# EAGLE design Main_mouse (EAGLE 8.3.2)
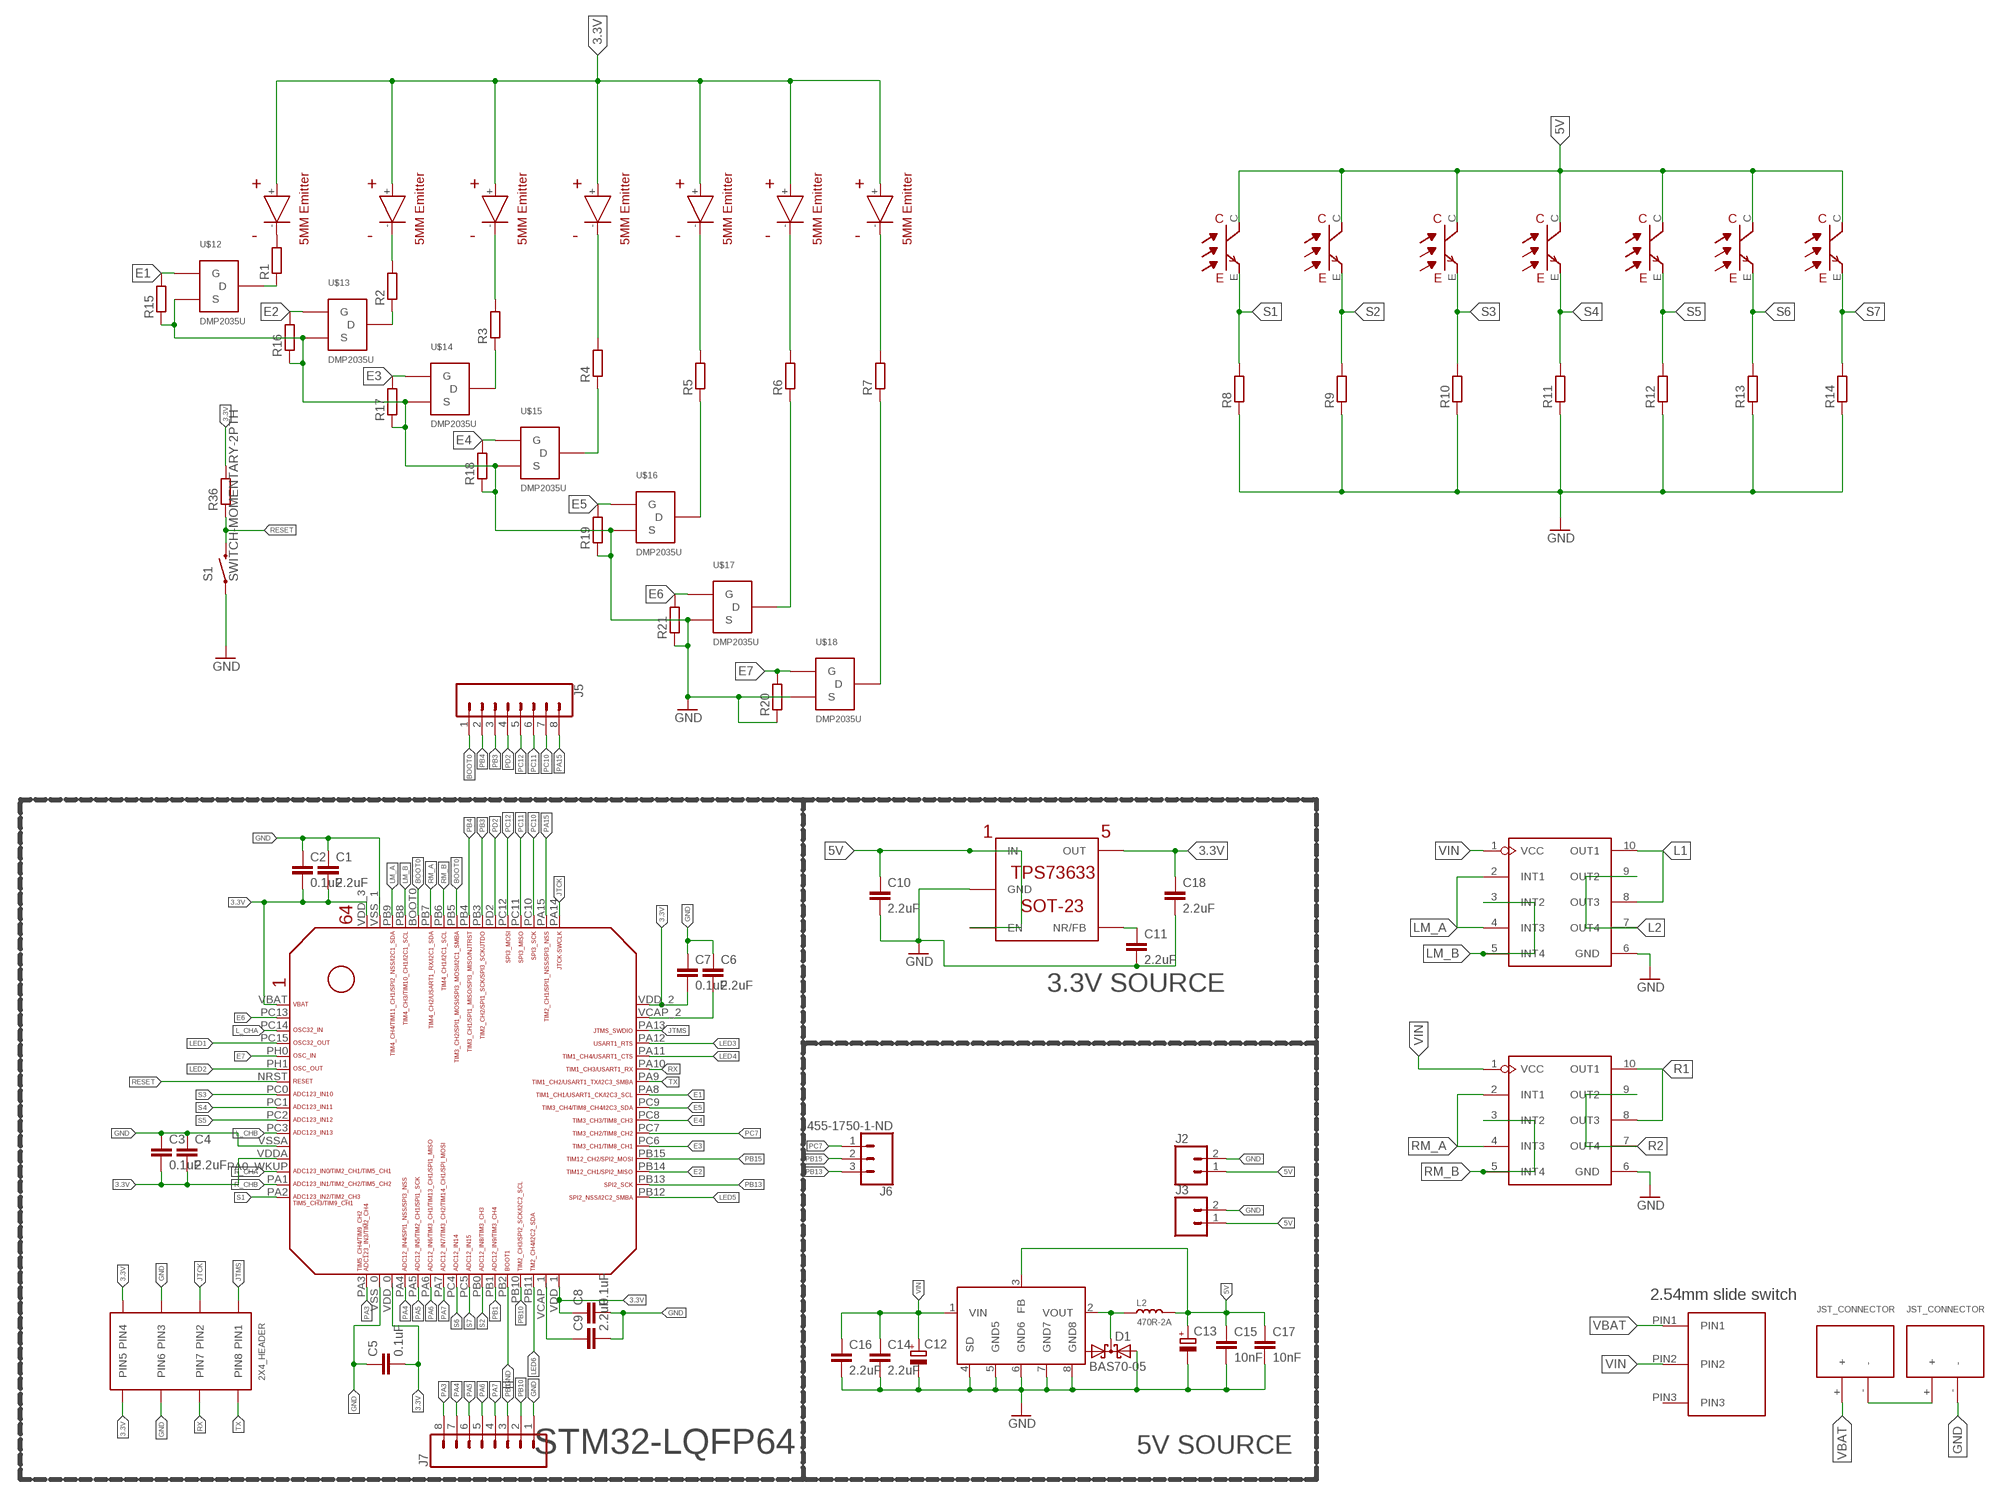
[diagram p0: schematic, sheet 1, part 1 of 2]
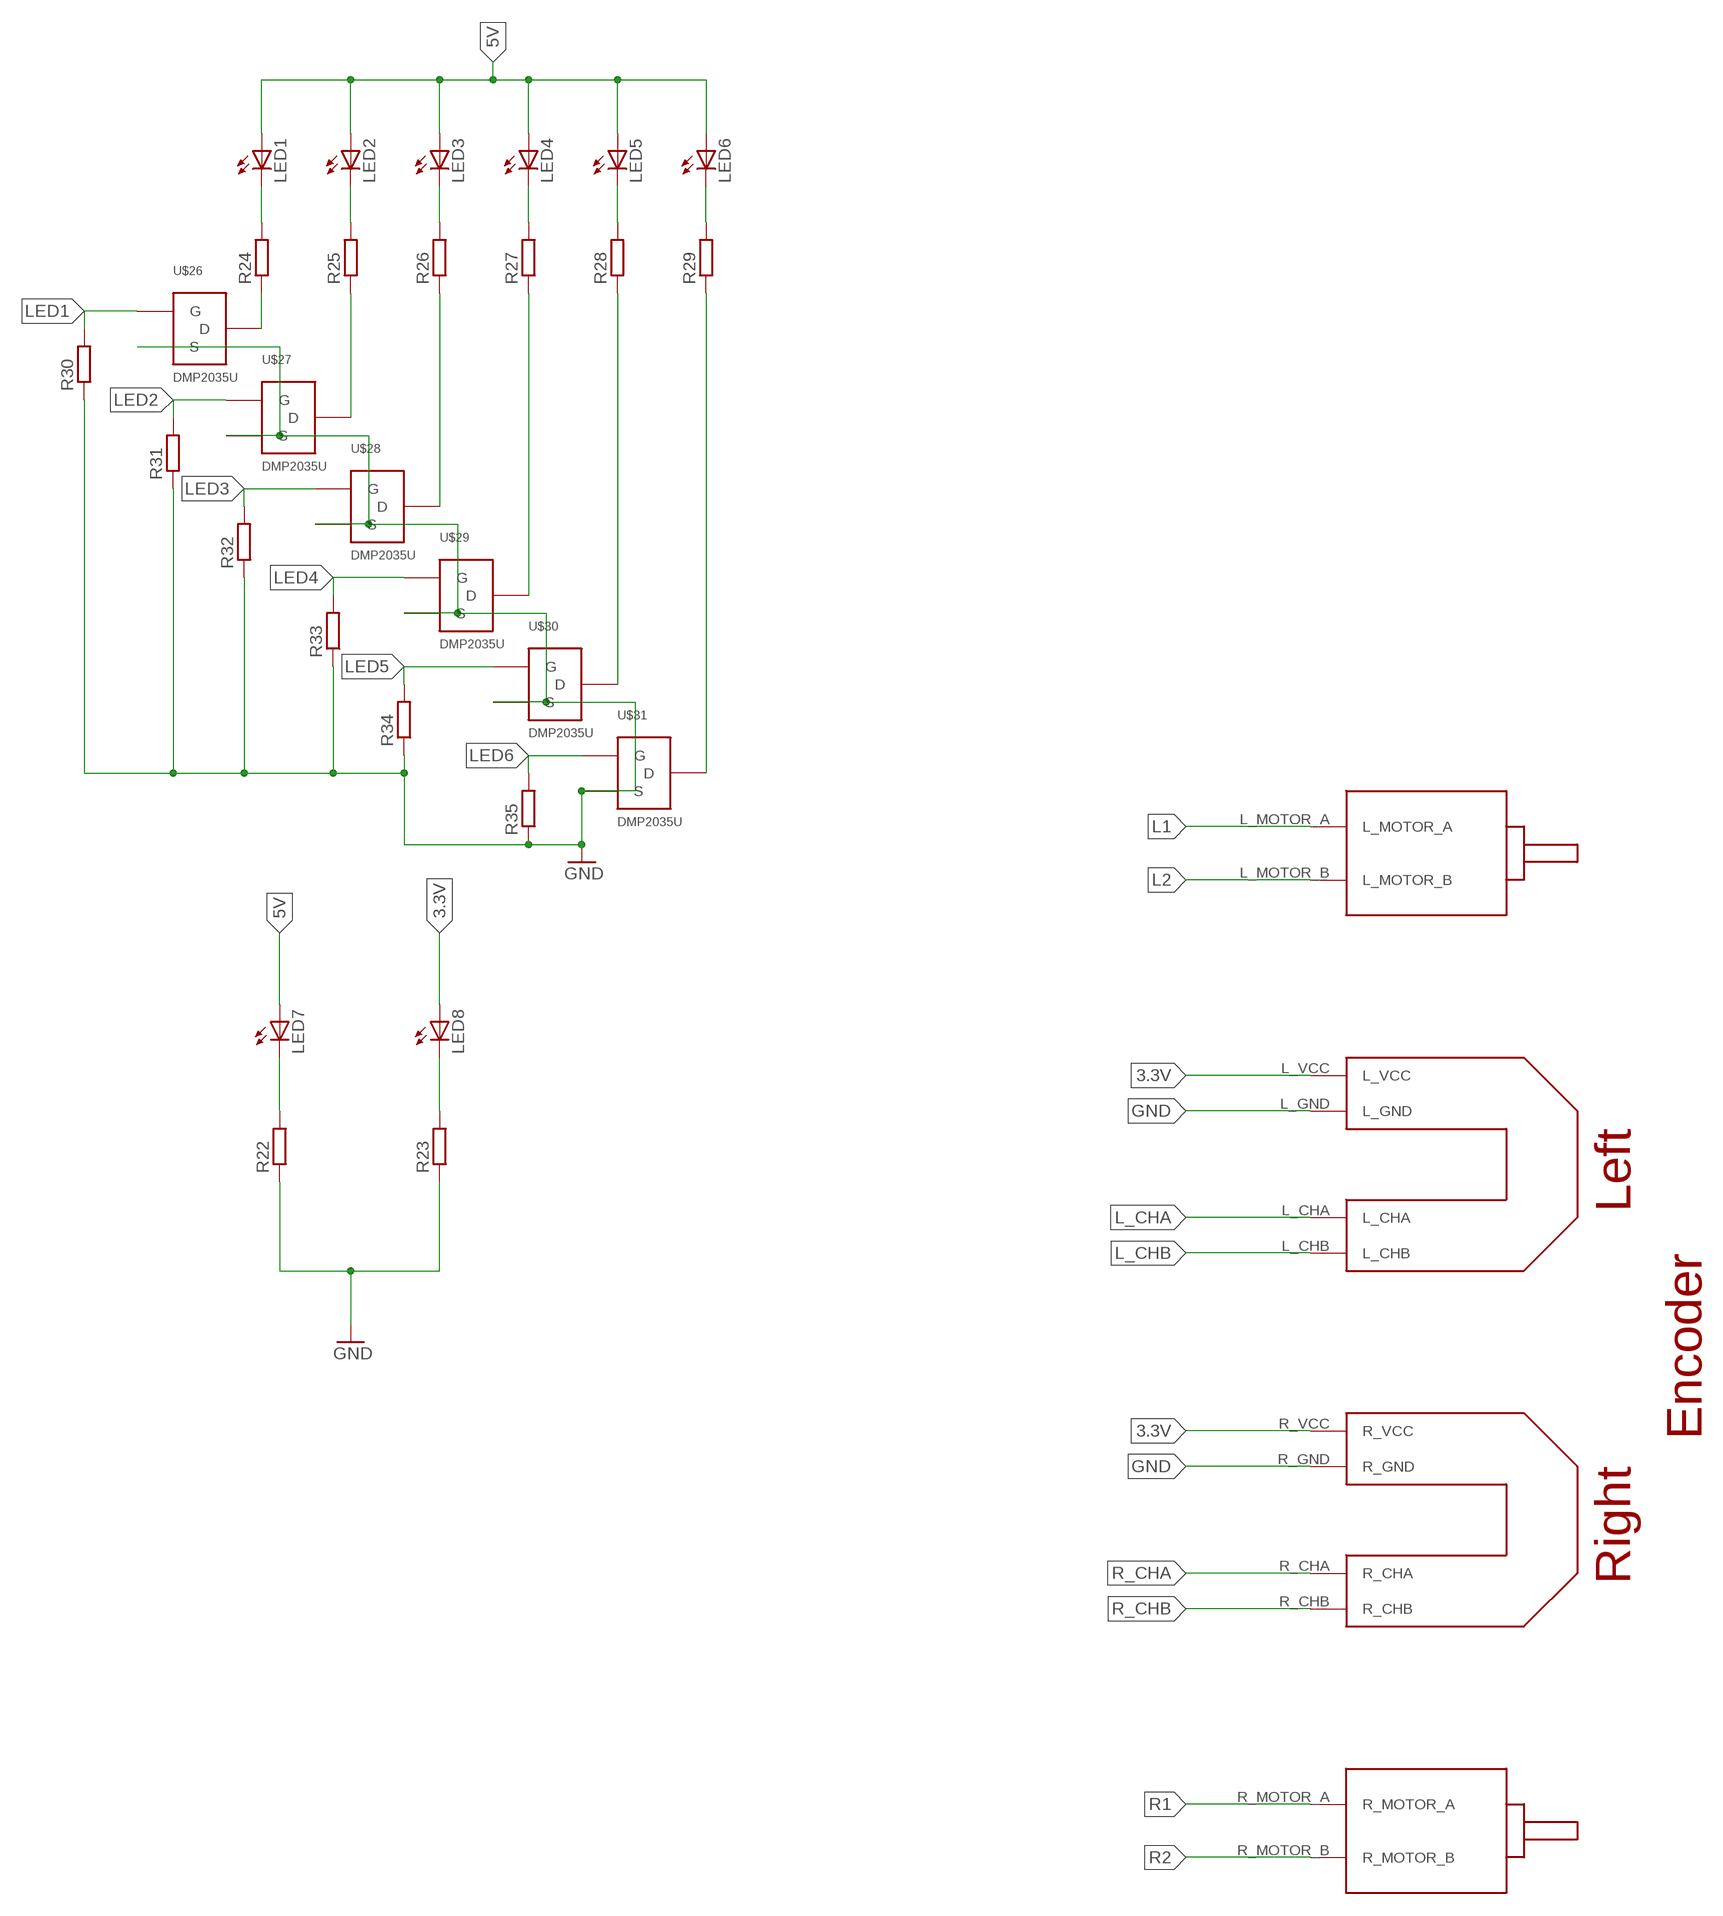
[diagram p1: schematic, sheet 1, part 2 of 2]

## Parts
C1  2.2uF  2.2UF-0603-10V-20%  [0603]
C2  0.1uF  0.1UF-0603-25V-(+80/-20%)  [0603]
C3  0.1uF  0.1UF-0603-25V-(+80/-20%)  [0603]
C4  2.2uF  2.2UF-0603-10V-20%  [0603]
C5  0.1uF  0.1UF-0603-25V-(+80/-20%)  [0603]
C6  2.2uF  2.2UF-0603-10V-20%  [0603]
C7  0.1uF  0.1UF-0603-25V-(+80/-20%)  [0603]
C8  0.1uF  0.1UF-0603-25V-(+80/-20%)  [0603]
C9  2.2uF  2.2UF-0603-10V-20%  [0603]
C10  2.2uF  2.2UF-0603-10V-20%  [0603]
C11  2.2uF  2.2UF-0603-10V-20%  [0603]
C12  CPOL-EUSMCA  [SMC_A]
C13  CPOL-EUSMCC  [SMC_C]
C14  2.2uF  2.2UF-0603-10V-20%  [0603]
C15  10nF  10NF-0603-50V-10%  [0603]
C16  2.2uF  2.2UF-0603-10V-20%  [0603]
C17  10nF  10NF-0603-50V-10%  [0603]
C18  2.2uF  2.2UF-0603-10V-20%  [0603]
D1  BAS70-05  [SOT23]
J2  CONN_02PTH3  [1X02_LONGPADS]
J3  CONN_02PTH3  [1X02_LONGPADS]
J5  CONN_08NO_SILK_FEMALE_PTH  [1X08_NO_SILK]
J6  455-1750-1-ND  CONN_03  [1X03]
J7  CONN_08NO_SILK_FEMALE_PTH  [1X08_NO_SILK]
L2  470R-2A  SMD-FERRITE-BEAD-470R-2A(0805)'0805'  [L0805]
LED1  LEDCHIP-LED0603  [CHIP-LED0603]
LED2  LEDCHIP-LED0603  [CHIP-LED0603]
LED3  LEDCHIP-LED0603  [CHIP-LED0603]
LED4  LEDCHIP-LED0603  [CHIP-LED0603]
LED5  LEDCHIP-LED0603  [CHIP-LED0603]
LED6  LEDCHIP-LED0603  [CHIP-LED0603]
LED7  LEDCHIP-LED0603  [CHIP-LED0603]
LED8  LEDCHIP-LED0603  [CHIP-LED0603]
R1  R-EU_R0603  [R0603]
R2  R-EU_R0603  [R0603]
R3  R-EU_R0603  [R0603]
R4  R-EU_R0603  [R0603]
R5  R-EU_R0603  [R0603]
R6  R-EU_R0603  [R0603]
R7  R-EU_R0603  [R0603]
R8  R-EU_R0603  [R0603]
R9  R-EU_R0603  [R0603]
R10  R-EU_R0603  [R0603]
R11  R-EU_R0603  [R0603]
R12  R-EU_R0603  [R0603]
R13  R-EU_R0603  [R0603]
R14  R-EU_R0603  [R0603]
R15  R-EU_R0603  [R0603]
R16  R-EU_R0603  [R0603]
R17  R-EU_R0603  [R0603]
R18  R-EU_R0603  [R0603]
R19  R-EU_R0603  [R0603]
R20  R-EU_R0603  [R0603]
R21  R-EU_R0603  [R0603]
R22  R-EU_R0603  [R0603]
R23  R-EU_R0603  [R0603]
R24  R-EU_R0603  [R0603]
R25  R-EU_R0603  [R0603]
R26  R-EU_R0603  [R0603]
R27  R-EU_R0603  [R0603]
R28  R-EU_R0603  [R0603]
R29  R-EU_R0603  [R0603]
R30  R-EU_R0603  [R0603]
R31  R-EU_R0603  [R0603]
R32  R-EU_R0603  [R0603]
R33  R-EU_R0603  [R0603]
R34  R-EU_R0603  [R0603]
R35  R-EU_R0603  [R0603]
R36  R-EU_R0603  [R0603]
S1  SWITCH-MOMENTARY-2PTH  [TACTILE-PTH]
U1  DRIVER-LV8548MC-AH(SOIC10)  [SOIC10-1.0-5X4MM]
U2  DRIVER-LV8548MC-AH(SOIC10)  [SOIC10-1.0-5X4MM]
U$1  STM32F405/415_LQFP64  [STM32F405/415_LQFP64]
U$2  2X3_HEADER  [2X3_HEADER]
U$3  AP1509-50SG-13  [SO08]
U$4  TPS73633(SOT-23)  [TPS73633(SOT-23)]
U$5  EMITTER  [EMITTER]
U$6  EMITTER  [EMITTER]
U$7  EMITTER  [EMITTER]
U$8  EMITTER  [EMITTER]
U$9  EMITTER  [EMITTER]
U$10  EMITTER  [EMITTER]
U$11  EMITTER  [EMITTER]
U$12  DMP2035U  [SOT23]
U$13  DMP2035U  [SOT23]
U$14  DMP2035U  [SOT23]
U$15  DMP2035U  [SOT23]
U$16  DMP2035U  [SOT23]
U$17  DMP2035U  [SOT23]
U$18  DMP2035U  [SOT23]
U$19  RECEIVER  [RECEIVER]
U$20  RECEIVER  [RECEIVER]
U$21  RECEIVER  [RECEIVER]
U$22  RECEIVER  [RECEIVER]
U$23  RECEIVER  [RECEIVER]
U$24  RECEIVER  [RECEIVER]
U$25  RECEIVER  [RECEIVER]
U$26  DMP2035U  [SOT23]
U$27  DMP2035U  [SOT23]
U$28  DMP2035U  [SOT23]
U$29  DMP2035U  [SOT23]
U$30  DMP2035U  [SOT23]
U$31  DMP2035U  [SOT23]
U$32  TS02_SWITCH  [TS02_SWITCH]
U$33  JST_CONNECTOR_FEMALE  [JST_CONNECTOR_FEMALE]
U$34  JST_CONNECTOR_FEMALE  [JST_CONNECTOR_FEMALE]
U$35  FUTURA_V1.0_MOTOR_MOUNT  [FUTURA_V1.0_MOTOT_MOUNT]

## Nets
3.3V: C1.2 C2.2 C3.2 C4.2 C5.2 C7.2 C8.1 C18.1 LED8.A R36.2 U$1.VBAT U$1.VDD_0 U$1.VDD_1 U$1.VDD_2 U$1.VDD_3 U$1.VDDA U$2.PIN4 U$2.PIN5 U$4.OUT U$5.+ U$6.+ U$7.+ U$8.+ U$9.+ U$10.+ U$11.+ U$35.L_VCC U$35.R_VCC
5V: C10.1 C13.+ C15.1 C17.1 J2.1 J3.1 L2.2 LED1.A LED2.A LED3.A LED4.A LED5.A LED6.A LED7.A U$3.3(FB) U$4.EN U$4.IN U$19.C U$20.C U$21.C U$22.C U$23.C U$24.C U$25.C
BOOT0: J5.1 U$1.BOOT0 U$1.PB5
E1: R15.2 U$1.PA8 U$12.1(G)
E2: R16.2 U$1.PB14 U$13.1(G)
E3: R17.2 U$1.PC6 U$14.1(G)
E4: R18.2 U$1.PC8 U$15.1(G)
E5: R19.2 U$1.PC9 U$16.1(G)
E6: R21.2 U$1.PC13 U$17.1(G)
E7: R20.2 U$1.PH0 U$18.1(G)
GND: C1.1 C2.1 C3.1 C4.1 C5.1 C6.1 C7.1 C8.2 C9.2 C10.2 C11.2 C12.- C13.- C14.2 C15.2 C16.2 C17.2 C18.2 D1.2(A2) J2.2 J3.2 J7.1 R8.1 R9.1 R10.1 R11.1 R12.1 R13.1 R14.1 R15.1 R16.1 R17.1 R18.1 R19.1 R20.1 R21.1 R22.1 R23.1 R30.1 R31.1 R32.1 R33.1 R34.1 R35.1 S1.1 U1.6(GND) U2.6(GND) U$1.PB2 U$1.VSS_0 U$1.VSS_1 U$1.VSSA U$2.PIN3 U$2.PIN6 U$3.4(SD) U$3.5(GND5) U$3.6(GND6) U$3.7(GND7) U$3.8(GND8) U$4.GND U$12.2(S) U$13.2(S) U$14.2(S) U$15.2(S) U$16.2(S) U$17.2(S) U$18.2(S) U$26.2(S) U$27.2(S) U$28.2(S) U$29.2(S) U$30.2(S) U$31.2(S) U$34.- U$35.L_GND U$35.R_GND
JTCK: U$1.PA14 U$2.PIN2
JTMS: U$1.PA13 U$2.PIN1
L1: U1.8(OUT3) U1.10(OUT1) U$35.L_MOTOR_A
L2: U1.7(OUT4) U1.9(OUT2) U$35.L_MOTOR_B
L_CHA: U$1.PC14 U$35.L_CHA
L_CHB: U$1.PC3 U$35.L_CHB
LED1: R30.2 U$1.PC15 U$26.1(G)
LED2: R31.2 U$1.PH1 U$27.1(G)
LED3: R32.2 U$1.PA12 U$28.1(G)
LED4: R33.2 U$1.PA11 U$29.1(G)
LED5: R34.2 U$1.PB12 U$30.1(G)
LED6: R35.2 U$1.PB11 U$31.1(G)
LM_A: U1.2(INT1) U1.4(INT3) U$1.PB9
LM_B: U1.3(INT2) U1.5(INT4) U$1.PB8
N$1: C9.1 U$1.VCAP_1
N$2: C6.2 U$1.VCAP_2
N$3: R1.1 U$12.3(D)
N$4: D1.3(C) L2.1 U$3.2(VOUT)
N$5: C11.1 U$4.NR/FB
N$6: R2.2 U$6.-
N$7: R2.1 U$13.3(D)
N$8: R4.1 U$15.3(D)
N$10: R3.1 U$14.3(D)
N$11: R6.1 U$17.3(D)
N$12: R3.2 U$7.-
N$13: R1.2 U$5.-
N$14: R4.2 U$8.-
N$15: R5.2 U$9.-
N$16: R5.1 U$16.3(D)
N$17: R6.2 U$10.-
N$18: R7.1 U$18.3(D)
N$19: R7.2 U$11.-
N$20: LED7.C R22.2
N$21: LED8.C R23.2
N$22: LED1.C R24.2
N$23: LED2.C R25.2
N$24: LED3.C R26.2
N$25: LED4.C R27.2
N$26: LED5.C R28.2
N$27: LED6.C R29.2
N$28: R24.1 U$26.3(D)
N$29: R25.1 U$27.3(D)
N$30: R26.1 U$28.3(D)
N$31: R27.1 U$29.3(D)
N$32: R29.1 U$31.3(D)
N$33: R28.1 U$30.3(D)
N$34: U$33.- U$34.+
PA3: J7.8 U$1.PA3
PA4: J7.7 U$1.PA4
PA5: J7.6 U$1.PA5
PA6: J7.5 U$1.PA6
PA7: J7.4 U$1.PA7
PA15: J5.8 U$1.PA15
PB1: J7.3 U$1.PB1
PB3: J5.3 U$1.PB3
PB4: J5.2 U$1.PB4
PB10: J7.2 U$1.PB10
PB13: J6.3 U$1.PB13
PB15: J6.2 U$1.PB15
PC7: J6.1 U$1.PC7
PC10: J5.7 U$1.PC10
PC11: J5.6 U$1.PC11
PC12: J5.5 U$1.PC12
PD2: J5.4 U$1.PD2
R1: U2.8(OUT3) U2.10(OUT1) U$35.R_MOTOR_A
R2: U2.7(OUT4) U2.9(OUT2) U$35.R_MOTOR_B
R_CHA: U$1.PA0_WKUP(PA0_AKUP) U$35.R_CHA
R_CHB: U$1.PA1 U$35.R_CHB
RESET: R36.1 S1.3 U$1.NRST
RM_A: U2.2(INT1) U2.4(INT3) U$1.PB7
RM_B: U2.3(INT2) U2.5(INT4) U$1.PB6
RX: U$1.PA10 U$2.PIN7
S1: R8.2 U$1.PA2 U$19.E
S2: R9.2 U$1.PB0 U$20.E
S3: R10.2 U$1.PC0 U$21.E
S4: R11.2 U$1.PC1 U$22.E
S5: R12.2 U$1.PC2 U$23.E
S6: R13.2 U$1.PC4 U$24.E
S7: R14.2 U$1.PC5 U$25.E
TX: U$1.PA9 U$2.PIN8
VBAT: U$32.PIN1 U$33.+
VIN: C12.+ C14.1 C16.1 U1.1(VCC) U2.1(VCC) U$3.1(VIN) U$32.PIN2
Unconnected: D1.1(A1) U$32.PIN3

## Notes on the sheet
- 3.3V SOURCE
- STM32-LQFP64 | 5V SOURCE

## Library data of the parts
C1 C4 C6 C9-C11 C14 C16 C18 = SparkFun-Capacitors:2.2UF: 2.2µF ceramic capacitors A capacitor is a passive two-terminal electrical component used to store electrical energy temporarily in an electric field.; PROD_ID: CAP-07888
C2 C3 C5 C7 C8 = SparkFun-Capacitors:0.1UF: 0.1µF ceramic capacitors A capacitor is a passive two-terminal electrical component used to store electrical energy temporarily in an electric field.; PROD_ID: CAP-00810
C12 C13 = resistor:CPOL-EU: POLARIZED CAPACITOR, European symbol
C15 C17 = SparkFun-Capacitors:10NF: 0.01uF/10nF/10,000pF ceramic capacitors A capacitor is a passive two-terminal electrical component used to store electrical energy temporarily in an electric field. CAP-09321; PROD_ID: CAP-00867
D1 = diode:BAS70-05: Silicon Schottky Diodes General-purpose diode for high-speed switching
J2 J3 = SparkFun-Connectors:CONN_02: Multi connection point. Often used as Generic Header-pin footprint for 0.1 inch spaced/style header connections On any of the 0.1 inch spaced packages, you can populate with these: Break Away Headers - Straight <https://www.sparkfun.com/products/116> (PRT-00116) Break Away Male Headers - Right Angle <https://www.sparkfun.com/products/553> (PRT-00553) Female Headers <https://www.sparkfun.com/products/115> (PRT-00115) Break Away Headers - Machine Pin <https://www.sparkfun.com/products/117> (PRT-00117) Break Away Female Headers - Swiss Machine Pin <https://www.sparkfun.com/products/743> (PRT-00743) For SCREWTERMINALS and SPRING TERMINALS visit here: Screw Terimnals on SparkFun.com <https://www.sparkfun.com/search/results?term=Screw+Terminals> (5mm/3.5mm/2.54mm spacing) This device is also useful as a general connection point to wire up your design to another part of your project. Our various solder wires solder well into these plated through hole pads. Hook-Up Wire - Assortment (Stranded, 22 AWG) <https://www.sparkfun.com/products/11375> (PRT-11375) Hook-Up Wire - Assortment (Solid Core, 22 AWG) <https://www.sparkfun.com/products/11367> (PRT-11367) View the entire wire category on our website here <https://www.sparkfun.com/categories/141> Special notes: Molex polarized connector foot print use with: PRT-08233 with associated crimp pins and housings. 2.54_SCREWTERM for use with PRT-10571. 3.5mm Screw Terminal footprints for PRT-08084 5mm Screw Terminal footprints for use with PRT-08432
J5 J7 = SparkFun-Connectors:CONN_08: Multi connection point. Often used as Generic Header-pin footprint for 0.1 inch spaced/style header connections On any of the 0.1 inch spaced packages, you can populate with these: Break Away Headers - Straight <https://www.sparkfun.com/products/116> (PRT-00116) Break Away Male Headers - Right Angle <https://www.sparkfun.com/products/553> (PRT-00553) Female Headers <https://www.sparkfun.com/products/115> (PRT-00115) Break Away Headers - Machine Pin <https://www.sparkfun.com/products/117> (PRT-00117) Break Away Female Headers - Swiss Machine Pin <https://www.sparkfun.com/products/743> (PRT-00743) Arduino Stackable Header - 8 Pin <https://www.sparkfun.com/products/9279> (PRT-09279) For SCREWTERMINALS and SPRING TERMINALS visit here: Screw Terimnals on SparkFun.com <https://www.sparkfun.com/search/results?term=Screw+Terminals> (5mm/3.5mm/2.54mm spacing) This device is also useful as a general connection point to wire up your design to another part of your project. Our various solder wires solder well into these plated through hole pads. Hook-Up Wire - Assortment (Stranded, 22 AWG) <https://www.sparkfun.com/products/11375> (PRT-11375) Hook-Up Wire - Assortment (Solid Core, 22 AWG) <https://www.sparkfun.com/products/11367> (PRT-11367) View the entire wire category on our website here <https://www.sparkfun.com/categories/141> Special notes: Molex polarized connector foot print use with SKU : PRT-08231 with associated crimp pins and housings. 1MM SMD Version SKU: PRT-10208 NOTES ON THE VARIANTS LOCK and LOCK_LONGPADS... This footprint was designed to help hold the alignment of a through-hole component (i.e. 6-pin header) while soldering it into place. You may notice that each hole has been shifted either up or down by 0.005 of an inch from it's more standard position (which is a perfectly straight line). This slight alteration caused the pins (the squares in the middle) to touch the edges of the holes. Because they are alternating, it causes a "brace" to hold the component in place. 0.005 has proven to be the perfect amount of "off-center" position when using our standard breakaway headers. Although looks a little odd when you look at the bare footprint, once you have a header in there, the alteration is very hard to notice. Also,if you push a header all the way into place, it is covered up entirely on the bottom side.; PROD_ID: CONN-08438
J6 = SparkFun-Connectors:CONN_03: Multi connection point. Often used as Generic Header-pin footprint for 0.1 inch spaced/style header connections On any of the 0.1 inch spaced packages, you can populate with these: Break Away Headers - Straight <https://www.sparkfun.com/products/116> (PRT-00116) Break Away Male Headers - Right Angle <https://www.sparkfun.com/products/553> (PRT-00553) Female Headers <https://www.sparkfun.com/products/115> (PRT-00115) Break Away Headers - Machine Pin <https://www.sparkfun.com/products/117> (PRT-00117) Break Away Female Headers - Swiss Machine Pin <https://www.sparkfun.com/products/743> (PRT-00743) Stackable Header - 3 Pin (Female, 0.1") <https://www.sparkfun.com/products/13875> (PRT-13875) For SCREWTERMINALS and SPRING TERMINALS visit here: Screw Terimnals on SparkFun.com <https://www.sparkfun.com/search/results?term=Screw+Terminals> (5mm/3.5mm/2.54mm spacing) This device is also useful as a general connection point to wire up your design to another part of your project. Our various solder wires solder well into these plated through hole pads. Hook-Up Wire - Assortment (Stranded, 22 AWG) <https://www.sparkfun.com/products/11375> (PRT-11375) Hook-Up Wire - Assortment (Solid Core, 22 AWG) <https://www.sparkfun.com/products/11367> (PRT-11367) View the entire wire category on our website here <https://www.sparkfun.com/categories/141> Special notes: Molex polarized connector foot print use with SKU : PRT-08232 with associated crimp pins and housings.; PROD_ID: XXX-00000
L2 = Seeed-Inductor:SMD-FERRITE-BEAD-470R-2A(0805): 303030008; MPN: WLB2012-471T20
LED1-LED8 = led:LED: LED OSRAM: - CHIPLED LG R971, LG N971, LY N971, LG Q971, LY Q971, LO R971, LY R971 LH N974, LH R974 LS Q976, LO Q976, LY Q976 LO Q996 - Hyper CHIPLED LW Q18S LB Q993, LB Q99A, LB R99A - SideLED LS A670, LO A670, LY A670, LG A670, LP A670 LB A673, LV A673, LT A673, LW A673 LH A674 LY A675 LS A676, LA A676, LO A676, LY A676, LW A676 LS A679, LY A679, LG A679 - Hyper Micro SIDELED® LS Y876, LA Y876, LO Y876, LY Y876 LT Y87S - SmartLED LW L88C, LW L88S LB L89C, LB L89S, LG L890 LS L89K, LO L89K, LY L89K LS L896, LA L896, LO L896, LY L896 - TOPLED LS T670, LO T670, LY T670, LG T670, LP T670 LSG T670, LSP T670, LSY T670, LOP T670, LYG T670 LG T671, LOG T671, LSG T671 LB T673, LV T673, LT T673, LW T673 LH T674 LS T676, LA T676, LO T676, LY T676, LB T676, LH T676, LSB T676, LW T676 LB T67C, LV T67C, LT T67C, LS T67K, LO T67K, LY T67K, LW E67C LS E67B, LA E67B, LO E67B, LY E67B, LB E67C, LV E67C, LT E67C LW T67C LS T679, LY T679, LG T679 LS T770, LO T770, LY T770, LG T770, LP T770 LB T773, LV T773, LT T773, LW T773 LH T774 LS E675, LA E675, LY E675, LS T675 LS T776, LA T776, LO T776, LY T776, LB T776 LHGB T686 LT T68C, LB T68C - Hyper Mini TOPLED® LB M676 - Mini TOPLED Santana® LG M470 LS M47K, LO M47K, LY M47K Source: http://www.osram.convergy.de LUXEON: - LUMILED® LXK2-PW12-R00, LXK2-PW12-S00, LXK2-PW14-U00, LXK2-PW14-V00 LXK2-PM12-R00, LXK2-PM12-S00, LXK2-PM14-U00 LXK2-PE12-Q00, LXK2-PE12-R00, LXK2-PE12-S00, LXK2-PE14-T00, LXK2-PE14-U00 LXK2-PB12-K00, LXK2-PB12-L00, LXK2-PB12-M00, LXK2-PB14-N00, LXK2-PB14-P00, LXK2-PB14-Q00 LXK2-PR12-L00, LXK2-PR12-M00, LXK2-PR14-Q00, LXK2-PR14-R00 LXK2-PD12-Q00, LXK2-PD12-R00, LXK2-PD12-S00 LXK2-PH12-R00, LXK2-PH12-S00 LXK2-PL12-P00, LXK2-PL12-Q00, LXK2-PL12-R00 Source: www.luxeon.com KINGBRIGHT: KA-3528ASYC Source: www.kingbright.com
R1-R36 = resistor:R-EU_: RESISTOR, European symbol
S1 = SparkFun:SWITCH-MOMENTARY-2
U1 U2 = DRIVER-LV8548MC-AH_SOIC10_:DRIVER-LV8548MC-AH(SOIC10): 310030259; AVAILABILITY: Unavailable; DESCRIPTION: LV8548MC Series 16 V 1 A 1 W Dual Ch Forward/Reverse Motor Driver - MFP-10S; MF: ON Semiconductor; MP: LV8548MC-AH; PACKAGE: SOIC-10 ON Semiconductor; PRICE: None
U$1 = STM32F10x F4xx:STM32F405/415_LQFP64
U$2 = 2X4_HEADER:2X3_HEADER
U$3 = AP1509-50SG-13:AP1509-50SG-13; AVAILABILITY: Unavailable; DESCRIPTION: Voltage Regulators - Switching SW REG CNV BUCK ASYN 150K 1.4 22V 5.0V; MF: Diodes Inc.; MP: AP1509-50SG-13; PACKAGE: SOP-8 Diodes Inc.; PRICE: None
U$4 = TPS73633(SOT-23):TPS73633(SOT-23)
U$5-U$11 = sfh4550 & teft4300:EMITTER
U$12-U$18 U$26-U$31 = DMP2035U:DMP2035U: Diodes Inc. DMP2035U-7 P-channel logic level mosfet; AVAILABILITY: Unavailable; DESCRIPTION: MOSFET, P CH, ESD, 20V, 3.6A, SOT23; Transistor Polarity: P Channel; Continuous Drain Current Id: -3.6A; Drain Source...; MF: Diodes Inc.; MP: DMP2035U; PACKAGE: SOT-23-3 Diodes Inc.; PRICE: None
U$19-U$25 = sfh4550 & teft4300:RECEIVER
U$32 = 2.54mm slide switch:TS02_SWITCH
U$33 U$34 = JST_CONNECTOR_FEMALE. through hole:JST_CONNECTOR_FEMALE
U$35 = Futura 1.0 motor mount template:FUTURA_V1.0_MOTOR_MOUNT

## Board
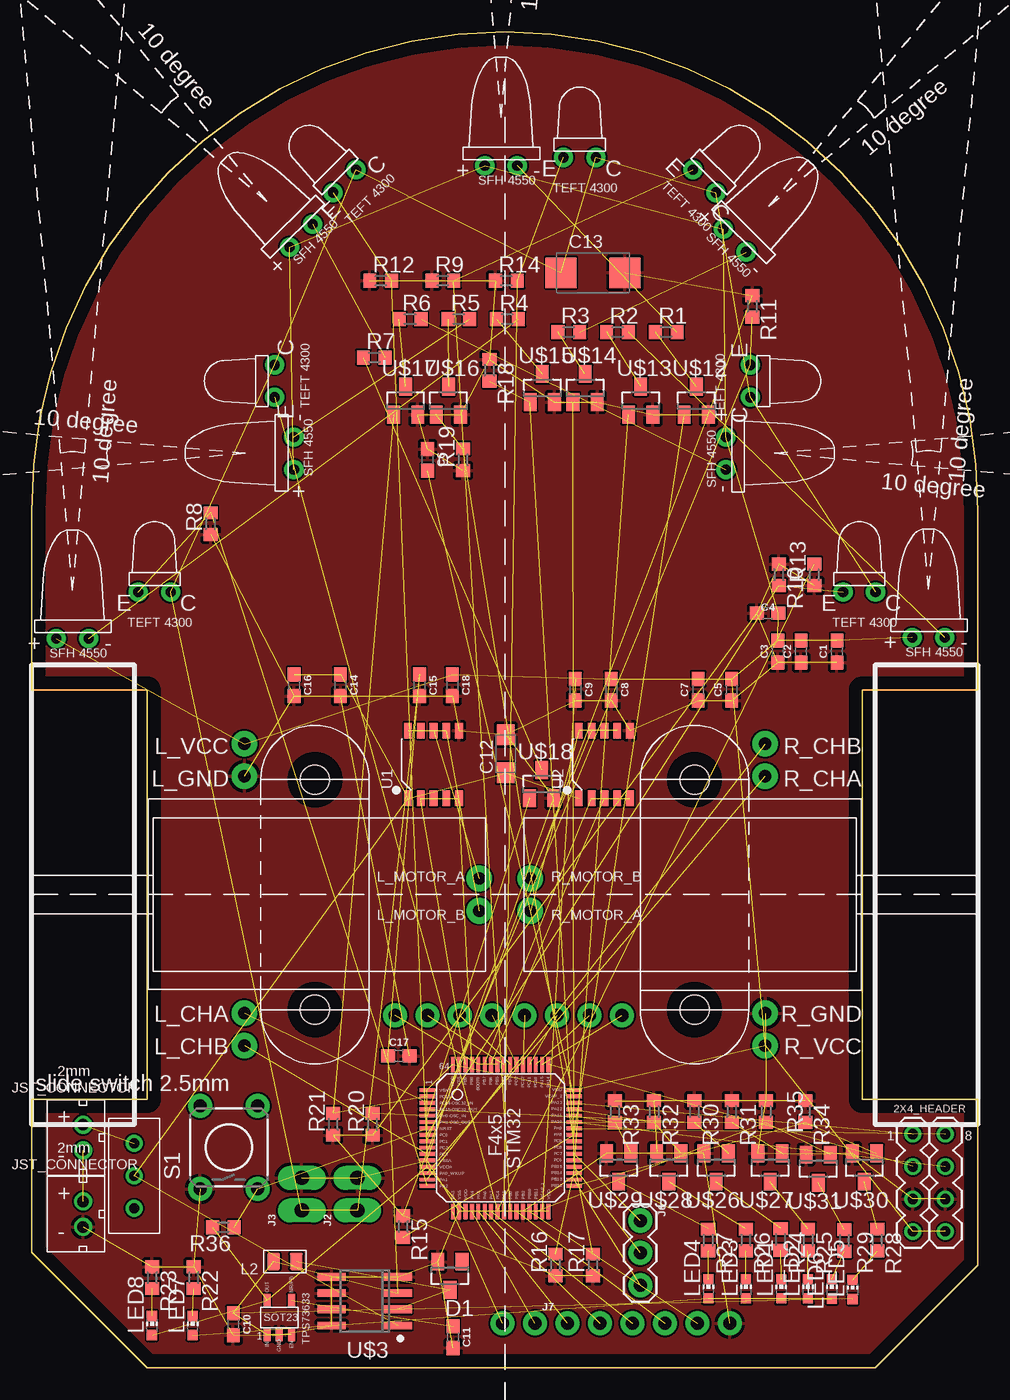
[diagram p2: board, top side]
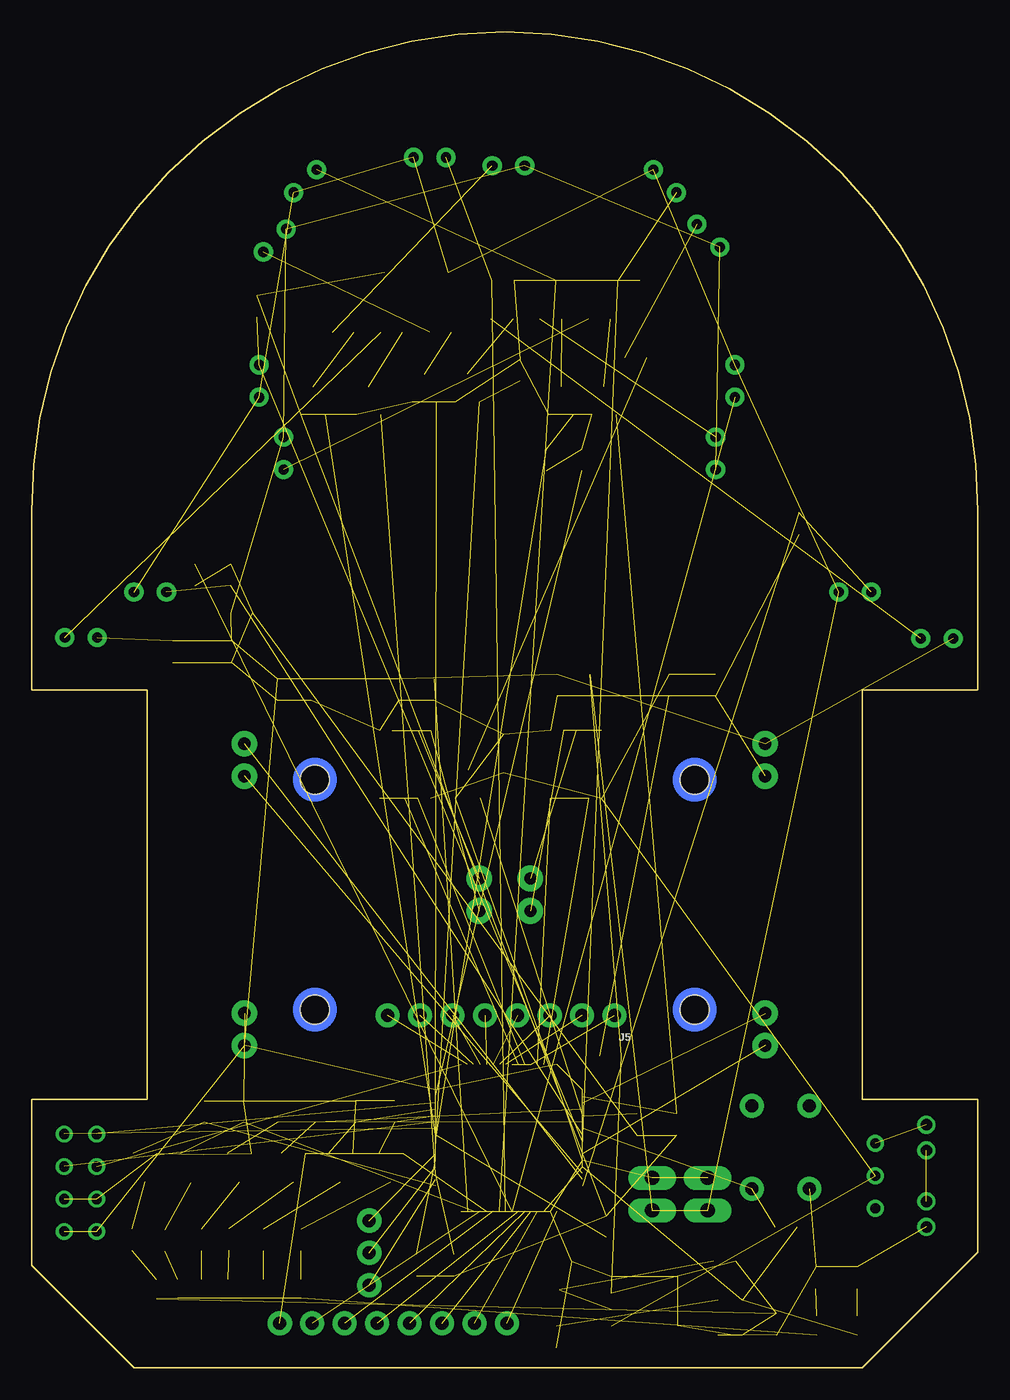
[diagram p3: board, bottom side, seen from below]

Size 74 x 104.5 mm. Coordinates in mm from the lower left corner, seen from the top.
Outline: 0,17 0,9 9,0 66,0 74,8 74,17
Outline: 0,57 0,67 arc-182 74,67 74,57
Copper layers (1*16): Top 0.035mm / dielectric 1.5mm / Bottom 0.035mm
Design rules "default": minimum track width 6mil, minimum drill 0.35mm, track to track 6mil, track to pad 6mil, pad to pad 6mil, via to via 6mil, smd to smd 6mil, copper to edge 40mil, drill to drill 6mil, minimum pad ring 10mil, minimum via ring 8mil, stop-mask expansion 4mil, vias tented up to drill 0mil, thermal gap 10mil

### Footprints (pad centres in the part's own frame; a part is rotated, then mirrored left to right if it is on the bottom)
0603 = smd 1.1 x 1: 1 -0.85,0; 2 0.85,0
SMC_A = smd 1.6 x 1.4: + -1.5,0; - 1.5,0
SMC_C = smd 2.4 x 2.4: + -2.5,0; - 2.5,0
SOT23 = smd 1 x 1.4: 1 -0.95,-1.1; 2 0.95,-1.1; 3 0,1.1
1X02_LONGPADS = drill 1.118 pad 1.88 long: 1 0,0; 2 2.54,0
1X08_NO_SILK = drill 1.016 pad 1.88: 1 0,0; 2 2.54,0; 3 5.08,0; 4 7.62,0; 5 10.16,0; 6 12.7,0; 7 15.24,0; 8 17.78,0
1X03 = drill 1.016 pad 1.88: 1 0,0; 2 2.54,0; 3 5.08,0
L0805 = smd 1.016 x 1.397: 1 -0.889,0; 2 0.889,0
CHIP-LED0603 = smd 0.8 x 0.8: A 0,-0.75; C 0,0.75
R0603 = smd 1 x 1.1: 1 -0.85,0; 2 0.85,0
TACTILE-PTH = drill 1.016 pad 1.88: 1 -3.251,2.261; 2 3.251,2.261; 3 -3.251,-2.261; 4 3.251,-2.261
SOIC10-1.0-5X4MM = smd 0.6 x 1.2: 1 -2,-2.65; 2 -1,-2.65; 3 0,-2.65; 4 1,-2.65; 5 2,-2.65; 6 2,2.65; 7 1,2.65; 8 0,2.65; 9 -1,2.65; 10 -2,2.65
STM32F405/415_LQFP64 = smd 1.2 x 0.3: BOOT0 -5.75,-1.75; PA3 5.75,-3.75; PA4 5.75,-2.25; PA5 5.75,-1.75; PA6 5.75,-1.25; PA7 5.75,-0.75; PA14 -5.75,3.75; PA15 -5.75,3.25; PB0 5.75,0.75; PB1 5.75,1.25; PB2 5.75,1.75; PB3 -5.75,0.75; PB4 -5.75,0.25; PB5 -5.75,-0.25; PB6 -5.75,-0.75; PB7 -5.75,-1.25; PB8 -5.75,-2.25; PB9 -5.75,-2.75; PB10 5.75,2.25; PB11 5.75,2.75; PC4 5.75,-0.25; PC5 5.75,0.25; PC10 -5.75,2.75; PC11 -5.75,2.25; PC12 -5.75,1.75; PD2 -5.75,1.25; VCAP_1 5.75,3.25; VDD_0 5.75,-2.75; VDD_1 5.75,3.75; VDD_3 -5.75,-3.75; VSS_0 5.75,-3.25; VSS_1 -5.75,-3.25 | smd 0.3 x 1.2: NRST -0.75,-5.75; PA0_WKUP 2.75,-5.75; PA1 3.25,-5.75; PA2 3.75,-5.75; PA8 -0.25,5.75; PA9 -0.75,5.75; PA10 -1.25,5.75; PA11 -1.75,5.75; PA12 -2.25,5.75; PA13 -2.75,5.75; PB12 3.75,5.75; PB13 3.25,5.75; PB14 2.75,5.75; PB15 2.25,5.75; PC0 -0.25,-5.75; PC1 0.25,-5.75; PC2 0.75,-5.75; PC3 1.25,-5.75; PC6 1.75,5.75; PC7 1.25,5.75; PC8 0.75,5.75; PC9 0.25,5.75; PC13 -3.25,-5.75; PC14 -2.75,-5.75; PC15 -2.25,-5.75; PH0 -1.75,-5.75; PH1 -1.25,-5.75; VBAT -3.75,-5.75; VCAP_2 -3.25,5.75; VDD_2 -3.75,5.75; VDDA 2.25,-5.75; VSSA 1.75,-5.75
2X3_HEADER = drill 0.8: PIN1 -1.27,3.81; PIN2 -1.27,1.27; PIN3 -1.27,-1.27; PIN4 -1.27,-3.81; PIN5 1.27,-3.81; PIN6 1.27,-1.27; PIN7 1.27,1.27; PIN8 1.27,3.81
SO08 = smd 0.6 x 2.2: 1 -1.905,-2.6; 2 -0.635,-2.6; 3 0.635,-2.6; 4 1.905,-2.6; 5 1.905,2.6; 6 0.635,2.6; 7 -0.635,2.6; 8 -1.905,2.6
TPS73633(SOT-23) = smd 0.55 x 1: EN 0.95,-1.35; GND 0,-1.35; IN -0.95,-1.35; NR/FB 0.95,1.35; OUT -0.95,1.35
EMITTER = drill 0.8 pad 1.5: + -1.27,-0.5; - 1.27,-0.5
RECEIVER = drill 0.8 pad 1.5: C 1.27,-0.5; E -1.27,-0.5
TS02_SWITCH = drill 0.8: PIN1 0,2.54; PIN2 0,0; PIN3 0,-2.54
JST_CONNECTOR_FEMALE = drill 0.889: + 0,1; - 0,-1
FUTURA_V1.0_MOTOT_MOUNT = drill 0.95 pad 2: L_CHA -20.375,26.73; L_CHB -20.375,24.19; L_GND -20.375,45.27; L_MOTOR_A -2,37.27; L_MOTOR_B -2,34.73; L_VCC -20.375,47.81; R_CHA 20.375,45.27; R_CHB 20.375,47.81; R_GND 20.375,26.73; R_MOTOR_A 2,34.73; R_MOTOR_B 2,37.27; R_VCC 20.375,24.19 | hole 2.286: 14.85,45; 14.85,27; -14.85,27; -14.85,45

### Placement (x,y rotation side)
C1  63,56.03 90 top
C2  60.19,56.03 90 top
C3  58.38,56.03 90 top
C4  57.57,59.03 0 top
C5  54.76,53.03 90 top
C6  30.95,71.03 270 top
C7  52.14,53.03 90 top
C8  45.33,53.03 270 top
C9  42.52,53.03 270 top
C10  15.76,3.38 270 top
C11  32.95,2.38 270 top
C12  37.08,48.03 90 top
C13  43.9,85.66 0 top
C14  24.14,53.38 270 top
C15  30.33,53.38 270 top
C16  20.52,53.38 270 top
C17  28.71,24.38 0 top
C18  32.9,53.38 270 top
D1  32.71,7.19 180 top
J2  25.47,12.3 90 top
J3  21.12,12.3 90 top
J5  28.4,27.55 180 bottom
J6  47.6,11.5 270 top
J7  54.6,3.45 180 top
L2  19.8,8.3 180 top
LED1  58.64,6.17 0 top
LED2  60.73,6.16 0 top
LED3  55.88,6.16 0 top
LED4  52.94,6.16 0 top
LED5  64.22,6.12 0 top
LED6  62.6,6.16 0 top
LED7  12.58,3.29 0 top
LED8  9.4,3.29 0 top
R1  49.64,81.03 0 top
R2  45.83,81.03 0 top
R3  42.02,81.03 0 top
R4  37.21,82.03 0 top
R5  33.4,82.03 0 top
R6  29.59,82.03 0 top
R7  26.78,79.03 0 top
R8  13.97,66.03 90 top
R9  32.16,85.03 0 top
R10  58.45,62.03 270 top
R11  56.37,83.03 270 top
R12  27.29,85.03 0 top
R13  61.21,62.03 90 top
R14  37.13,85.03 0 top
R15  29.05,11.03 270 top
R16  40.97,8.03 90 top
R17  43.89,8.03 90 top
R18  35.81,78.03 270 top
R19  33.73,71.03 90 top
R20  26.65,19.03 90 top
R21  23.57,19.03 90 top
R22  12.66,7.03 270 top
R23  9.41,7.03 270 top
R24  58.59,10.03 270 top
R25  60.73,9.99 270 top
R26  55.87,9.99 270 top
R27  52.92,9.99 270 top
R28  66.14,9.99 270 top
R29  63.59,9.94 270 top
R30  51.85,20.03 270 top
R31  54.77,20.03 270 top
R32  48.69,20.03 270 top
R33  45.61,20.03 270 top
R34  60.53,20.03 270 top
R35  57.45,20.03 270 top
R36  14.98,10.98 180 top
S1  15.41,17.22 90 top
U1  31.42,47.19 0 top
U2  44.8,47.19 0 top
U$1  36.68,17.96 270 top
U$2  70.21,14.46 0 top
U$3  26.04,5.19 90 top
U$4  19.36,3.92 0 top
U$5  36.71,94.54 0 top
U$6  70.15,57.63 0 top
U$7  55.35,88.54 315 top
U$8  3.17,57.54 0 top
U$9  19.99,71.54 90 top
U$10  54.81,71.54 270 top
U$11  20.71,88.92 45 top
U$12  51.99,75.65 0 top
U$13  47.64,75.65 0 top
U$14  43.29,76.65 0 top
U$15  39.94,76.65 0 top
U$16  32.59,75.65 0 top
U$17  29.24,75.65 0 top
U$18  39.89,45.65 0 top
U$19  9.59,61.19 0 top
U$20  52.97,93.19 315 top
U$21  64.75,61.19 0 top
U$22  56.73,77.19 270 top
U$23  24.11,93.19 45 top
U$24  18.49,77.19 90 top
U$25  42.87,95.19 0 top
U$26  53.54,15.65 180 top
U$27  57.76,15.65 180 top
U$28  49.84,15.65 180 top
U$29  45.92,15.65 180 top
U$30  65.14,15.65 180 top
U$31  61.53,15.56 180 top
U$32  8,15 0 top
U$33  4,18 0 top
U$34  4,12 0 top
U$35  37,1 0 top

### Tracks (layer width: path | path; a pad name or v marks a point on that pad's centre or on a via)
3.3V  (27 unrouted)
5V  (23 unrouted)
BOOT0  (2 unrouted)
E1  (2 unrouted)
E2  (2 unrouted)
E3  (2 unrouted)
E4  (2 unrouted)
E5  (2 unrouted)
E6  (2 unrouted)
E7  (2 unrouted)
GND  (74 unrouted)
  pour Top: -6,107 -6,-3 81,-3 81,107
JTCK  (1 unrouted)
JTMS  (1 unrouted)
L1  (2 unrouted)
L2  (2 unrouted)
L_CHA  (1 unrouted)
L_CHB  (1 unrouted)
LED1  (2 unrouted)
LED2  (2 unrouted)
LED3  (2 unrouted)
LED4  (2 unrouted)
LED5  (2 unrouted)
LED6  (2 unrouted)
LM_A  (2 unrouted)
LM_B  (2 unrouted)
N$1  (1 unrouted)
N$2  (1 unrouted)
N$3  (1 unrouted)
N$4  (2 unrouted)
N$5  (1 unrouted)
N$6  (1 unrouted)
N$7  (1 unrouted)
N$8  (1 unrouted)
N$10  (1 unrouted)
N$11  (1 unrouted)
N$12  (1 unrouted)
N$13  (1 unrouted)
N$14  (1 unrouted)
N$15  (1 unrouted)
N$16  (1 unrouted)
N$17  (1 unrouted)
N$18  (1 unrouted)
N$19  (1 unrouted)
N$20  (1 unrouted)
N$21  (1 unrouted)
N$22  (1 unrouted)
N$23  (1 unrouted)
N$24  (1 unrouted)
N$25  (1 unrouted)
N$26  (1 unrouted)
N$27  (1 unrouted)
N$28  (1 unrouted)
N$29  (1 unrouted)
N$30  (1 unrouted)
N$31  (1 unrouted)
N$32  (1 unrouted)
N$33  (1 unrouted)
N$34  (1 unrouted)
PA3  (1 unrouted)
PA4  (1 unrouted)
PA5  (1 unrouted)
PA6  (1 unrouted)
PA7  (1 unrouted)
PA15  (1 unrouted)
PB1  (1 unrouted)
PB3  (1 unrouted)
PB4  (1 unrouted)
PB10  (1 unrouted)
PB13  (1 unrouted)
PB15  (1 unrouted)
PC7  (1 unrouted)
PC10  (1 unrouted)
PC11  (1 unrouted)
PC12  (1 unrouted)
PD2  (1 unrouted)
R1  (2 unrouted)
R2  (2 unrouted)
R_CHA  (1 unrouted)
R_CHB  (1 unrouted)
RESET  (2 unrouted)
RM_A  (2 unrouted)
RM_B  (2 unrouted)
RX  (1 unrouted)
S1  (2 unrouted)
S2  (2 unrouted)
S3  (2 unrouted)
S4  (2 unrouted)
S5  (2 unrouted)
S6  (2 unrouted)
S7  (2 unrouted)
TX  (1 unrouted)
VBAT  (1 unrouted)
VIN  (6 unrouted)